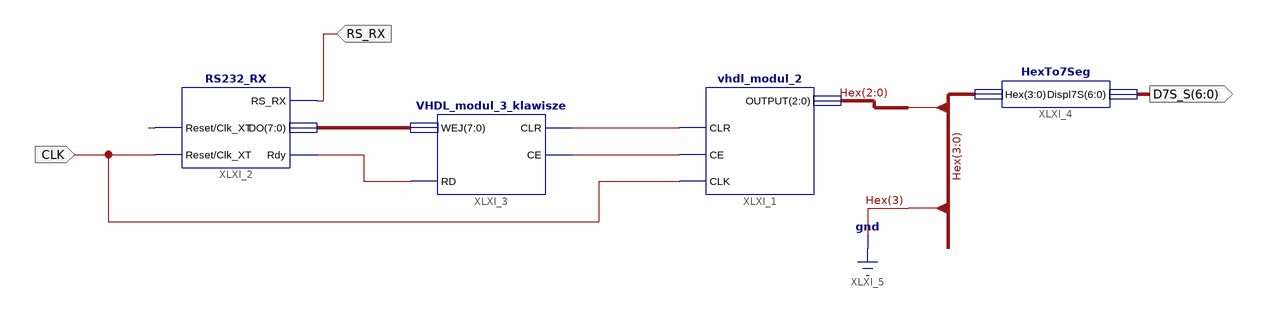
[diagram p0: schematic sheet 1]
// Xilinx ISE schematic schemat_3.sch (xc9500xl) as structural Verilog: 4 symbols, 3 ports
module schemat_3 (
  input  RS_RX,
  input  CLK,
  output [6:0] D7S_S
);

  wire XLXN_1, XLXN_2, XLXN_10;
  wire [2:0] Hex;
  wire [7:0] XLXN_9;

  vhdl_modul_2 XLXI_1 (.OUTPUT(Hex), .CLR(XLXN_1), .CE(XLXN_2), .CLK(CLK));
  RS232_RX XLXI_2 (.Reset(CLK), .Clk_XT(CLK), .Rdy(XLXN_10), .DO(XLXN_9), .RS_RX(RS_RX));
  VHDL_modul_3_klawisze XLXI_3 (.WEJ(XLXN_9), .CLR(XLXN_1), .CE(XLXN_2), .RD(XLXN_10));
  HexTo7Seg XLXI_4 (.Hex({1'b0, Hex}), .Displ7S(D7S_S));
endmodule
